# EAGLE design cart (EAGLE 8.7.1)
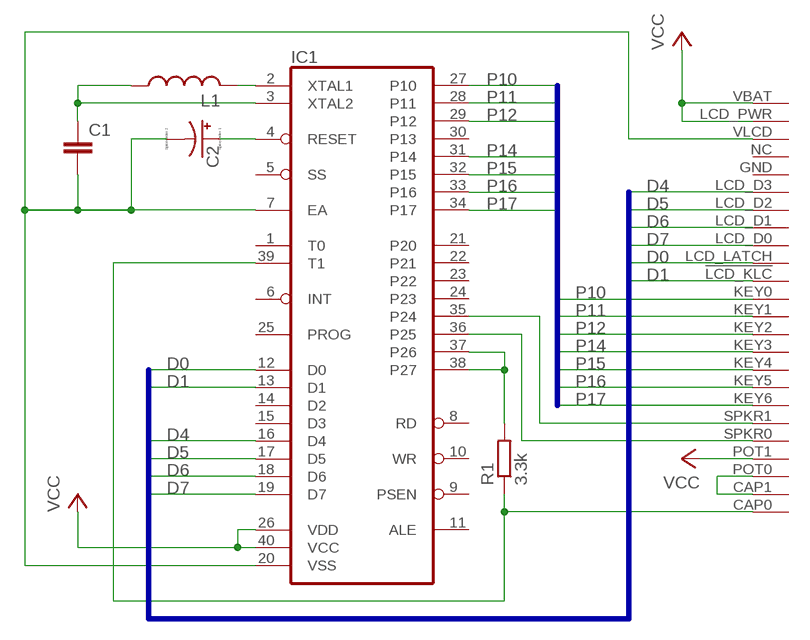
[diagram p0: schematic, sheet 1]

## Parts
C1  C-EU050-024X044  [C050-024X044]
C2  CPOL-USE2.5-5  [E2,5-5]
IC1  8748  [DIL40]
L1  L-US0207/10  [0207/10]
R1  3.3k  R-EU_0204/7  [0204/7]
U$1  CONNECTOR  [CONNECTOR]

## Nets
D0: IC1.12(D0) U$1.LCD_LATCH
D1: IC1.13(D1) U$1.!LCD_KLC(LCD_CLK)
D4: IC1.16(D4) U$1.LCD_D3
D5: IC1.17(D5) U$1.LCD_D2
D6: IC1.18(D6) U$1.LCD_D1
D7: IC1.19(D7) U$1.LCD_D0
N$8: IC1.35(P24) U$1.SPKR1
N$9: IC1.36(P25) U$1.SPKR0
N$10: IC1.37(P26) IC1.38(P27) R1.2
N$11: IC1.39(T1) R1.1 U$1.CAP0
N$12: C1.2 C2.- IC1.7(EA) IC1.20(VSS) U$1.VLCD
N$16: U$1.CAP1 U$1.POT0
N$19: IC1.2(XTAL1) L1.2
N$20: C1.1 IC1.3(XTAL2) L1.1
N$23: C2.+ IC1.4(RESET)
P10: IC1.27(P10) U$1.KEY0
P11: IC1.28(P11) U$1.KEY1
P12: IC1.29(P12) U$1.KEY2
P14: IC1.31(P14) U$1.KEY3
P15: IC1.32(P15) U$1.KEY4
P16: IC1.33(P16) U$1.KEY5
P17: IC1.34(P17) U$1.KEY6
VCC: IC1.26(VDD) IC1.40(VCC) U$1.LCD_PWR U$1.POT1 U$1.VBAT
Unconnected: IC1.1(T0) IC1.5(SS) IC1.6(INT) IC1.8(RD) IC1.9(PSEN) IC1.10(WR) IC1.11(ALE) IC1.14(D2) IC1.15(D3) IC1.21(P20) IC1.22(P21) IC1.23(P22) IC1.24(P23) IC1.25(PROG) IC1.30(P13) U$1.GND U$1.NC

## Buses
D[0..7]
P[10..17]

## Library data of the parts
C1 = resistor:C-EU: CAPACITOR, European symbol
C2 = resistor:CPOL-US: POLARIZED CAPACITOR, American symbol
IC1 = micro-intel:8748: MICROCOMPUTER/PERIPHERAL DEVICE; OC_FARNELL: unknown; OC_NEWARK: unknown
L1 = resistor:L-US: INDUCTOR, American symbol
R1 = resistor:R-EU_: RESISTOR, European symbol
U$1 = microvisionConnector:CONNECTOR

## Net classes
0 default: clearance 0.205 mm

## Board
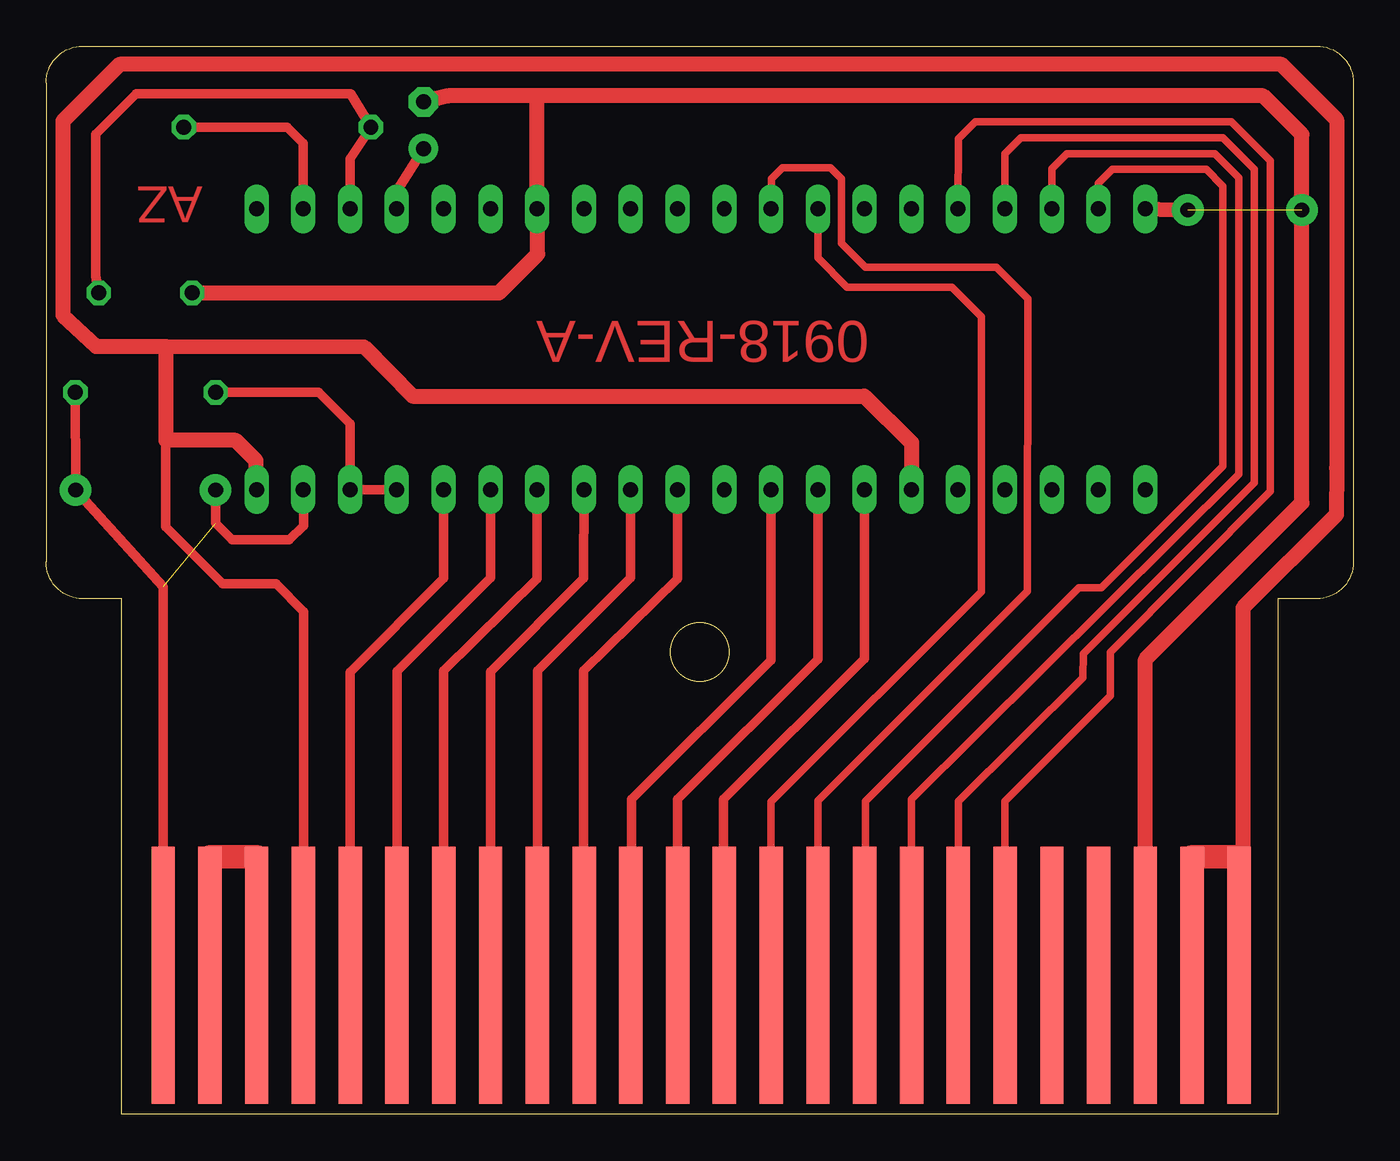
[diagram p1: board, top side]
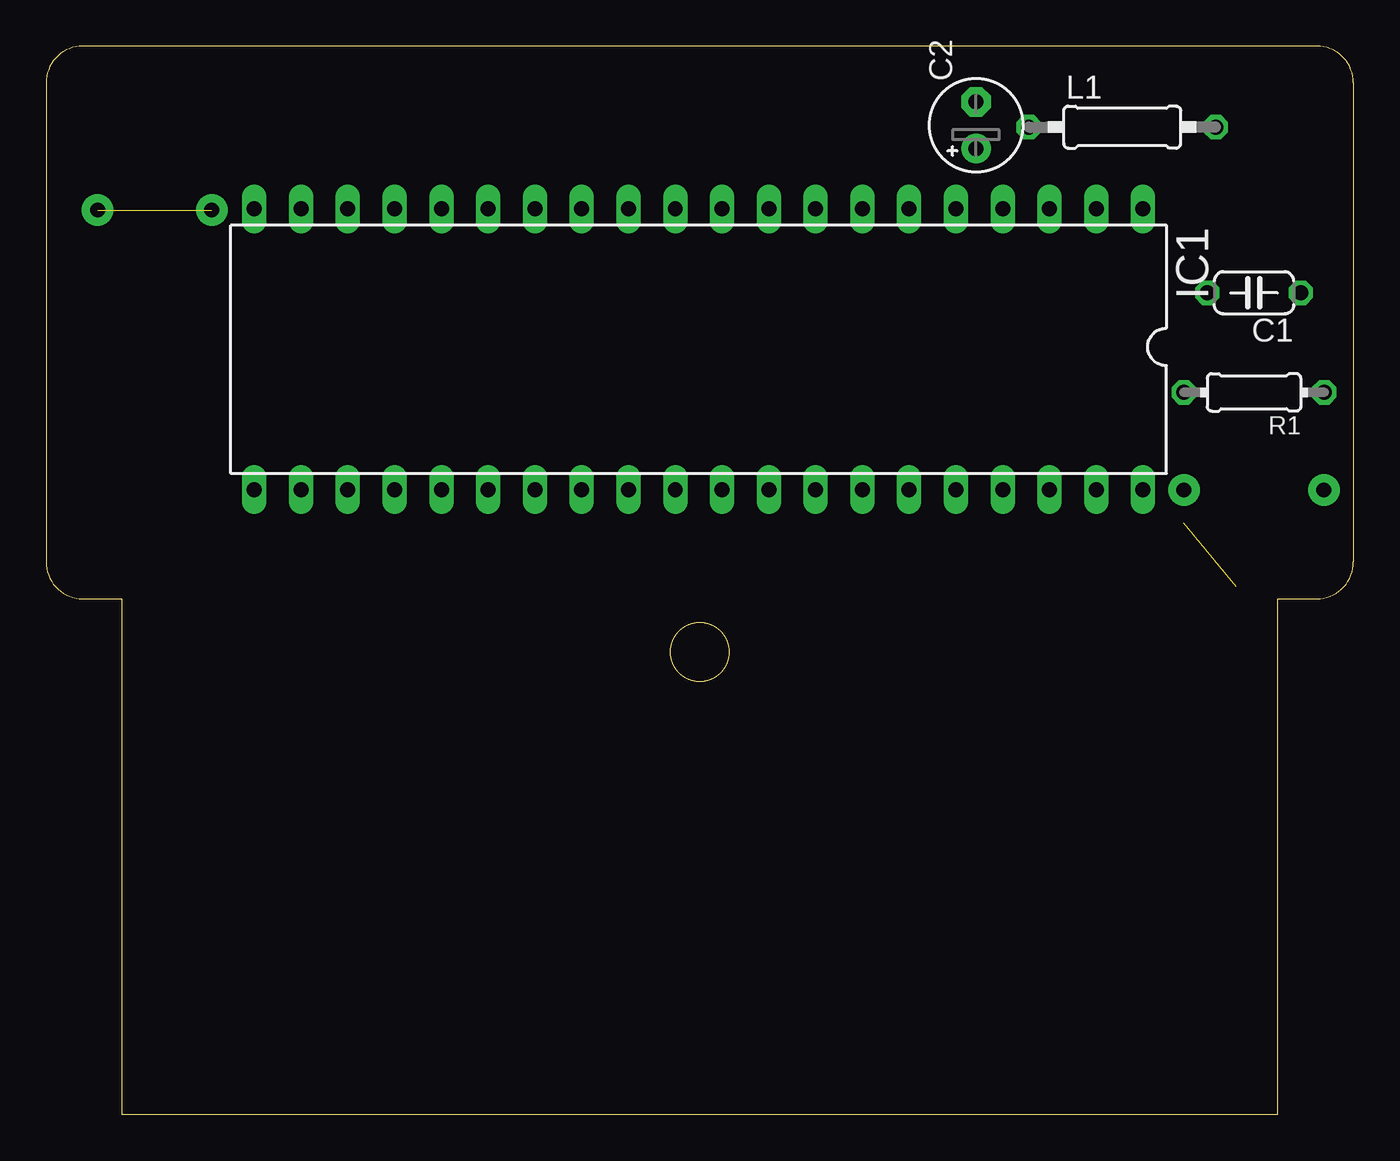
[diagram p2: board, bottom side, seen from below]

Size 71 x 58 mm. Coordinates in mm from the lower left corner, seen from the top.
Outline: 0,56 arc-90 2,58 69,58 arc-90 71,56 71,30 arc-90 69,28 66.9,28 66.9,0 4.1,0 4.1,28 2,28 arc-90 0,30 0,56
Outline: circle at 35.5,25.1 radius 1.6
Copper layers (1*16): Top 0.035mm / dielectric 1.5mm / Bottom 0.035mm
Design rules "default *": minimum track width 6mil, minimum drill 0.35mm, track to track 12mil, track to pad 12mil, pad to pad 12mil, via to via 12mil, smd to smd 12mil, copper to edge 20mil, drill to drill 6mil, minimum pad ring 10mil, minimum via ring 8mil, stop-mask expansion 4mil, vias tented up to drill 0mil, thermal gap 10mil

### Footprints (pad centres in the part's own frame; a part is rotated, then mirrored left to right if it is on the bottom)
C050-024X044 = drill 0.813 octagon: 1 -2.54,0; 2 2.54,0
E2,5-5 = drill 0.813 pad 1.6: + -1.27,0 | drill 0.813 pad 1.6 octagon: - 1.27,0
DIL40 = drill 0.813 long: 1 -24.13,-7.62; 2 -21.59,-7.62; 3 -19.05,-7.62; 4 -16.51,-7.62; 5 -13.97,-7.62; 6 -11.43,-7.62; 7 -8.89,-7.62; 8 -6.35,-7.62; 9 -3.81,-7.62; 10 -1.27,-7.62; 11 1.27,-7.62; 12 3.81,-7.62; 13 6.35,-7.62; 14 8.89,-7.62; 15 11.43,-7.62; 16 13.97,-7.62; 17 16.51,-7.62; 18 19.05,-7.62; 19 21.59,-7.62; 20 24.13,-7.62; 21 24.13,7.62; 22 21.59,7.62; 23 19.05,7.62; 24 16.51,7.62; 25 13.97,7.62; 26 11.43,7.62; 27 8.89,7.62; 28 6.35,7.62; 29 3.81,7.62; 30 1.27,7.62; 31 -1.27,7.62; 32 -3.81,7.62; 33 -6.35,7.62; 34 -8.89,7.62; 35 -11.43,7.62; 36 -13.97,7.62; 37 -16.51,7.62; 38 -19.05,7.62; 39 -21.59,7.62; 40 -24.13,7.62
0207/10 = drill 0.813 octagon: 1 -5.08,0; 2 5.08,0
0204/7 = drill 0.813 octagon: 1 -3.81,0; 2 3.81,0
CONNECTOR = smd 1.27 x 13.97: !LCD_KLC 5.08,-2.54; CAP0 -27.94,-2.54; CAP1 -25.4,-2.54; GND 20.32,-2.54; KEY0 2.54,-2.54; KEY1 0,-2.54; KEY2 -2.54,-2.54; KEY3 -5.08,-2.54; KEY4 -7.62,-2.54; KEY5 -10.16,-2.54; KEY6 -12.7,-2.54; LCD_D0 10.16,-2.54; LCD_D1 12.7,-2.54; LCD_D2 15.24,-2.54; LCD_D3 17.78,-2.54; LCD_LATCH 7.62,-2.54; LCD_PWR 27.94,-2.54; NC 22.86,-2.54; POT0 -22.86,-2.54; POT1 -20.32,-2.54; SPKR0 -17.78,-2.54; SPKR1 -15.24,-2.54; VBAT 30.48,-2.54; VLCD 25.4,-2.54

### Placement (x,y rotation side)
C1  5.4,44.6 180 bottom
C2  20.5,53.7 90 bottom
IC1  35.56,41.54 180 bottom
L1  12.56,53.6 0 bottom
R1  5.4,39.2 180 bottom
U$1  34.3,10.1 0 top

### Tracks (layer width: path | path; a pad name or v marks a point on that pad's centre or on a via)
D0
  Top 0.406: U$1.LCD_LATCH 41.92,17.02 53.3,28.4 53.33,44.27 51.6,46 44.5,46 43.2,47.3 43.2,50.8 42.6,51.4 40,51.4 39.4,50.8 39.4,49.6 IC1.12
D1
  Top 0.406: U$1.!LCD_KLC 39.38,16.98 50.8,28.38 50.8,43.3 49.2,44.9 43.5,44.9 41.91,46.51 IC1.13
D4
  Top 0.406: U$1.LCD_D3 52.08,17.02 57.8,22.74 57.8,25.1 66.49,33.83 66.49,51.77 64.37,53.89 50.47,53.89 49.54,52.96 IC1.16
D5
  Top 0.406: U$1.LCD_D2 49.54,17.01 56.3,23.7 56.33,25 65.63,34.28 65.63,51.31 63.92,53.03 52.95,53.03 52.08,52.16 IC1.17
D6
  Top 0.406: U$1.LCD_D1 47,17.1 64.76,34.74 64.76,50.86 63.46,52.16 55.44,52.16 54.61,51.33 IC1.18
D7
  Top 0.406: U$1.LCD_D0 44.5,7.6 44.5,17 56.1,28.6 57.3,28.6 63.9,35.2 63.9,50.4 63,51.3 57.9,51.3 57.15,50.55 IC1.19
N$8
  Top 0.508: U$1.SPKR1 19.06,24.06 24.13,29.13 IC1.35
N$9
  Top 0.508: U$1.SPKR0 16.52,24.02 21.6,29.1 21.6,31.91 IC1.36
N$10
  Top 0.508: R1.2 14.8,39.2 16.51,37.49 IC1.38 IC1.37
N$11  (via drill 0.81 pad 1.72)  (1 unrouted)
  Top 0.508: U$1.CAP0 6.36,28.66 v1.6,33.9 1.6,34.19 R1.1 | v9.2,33.9 9.2,32.1 10.11,31.2 13.2,31.19 14,31.95 IC1.39
N$12  (via drill 0.81 pad 1.72)  (1 unrouted)
  Top 0.813: U$1.VLCD 59.7,24.7 68.2,33.2 v68.2,49.1 68.2,53.2 66.1,55.3 26.7,55.3 | IC1.20 v62,49.1 | 26.7,55.3 21.83,55.3 C2.- | C1.2 24.6,44.6 26.7,46.7 26.7,49.13 IC1.7 26.67,55.27 26.7,55.3
N$16
  Top 1.016: U$1.CAP1 8.9,14 | 11.5,14 11.44,14 U$1.POT0
  Top 1.27: 8.9,14 11.44,14
N$19
  Top 0.508: IC1.2 13.97,52.73 13.1,53.6 L1.2
N$20
  Top 0.508: IC1.3 16.51,51.87 L1.1 16.54,55.4 4.9,55.4 2.7,53.2 2.7,45.5 C1.1
N$23
  Top 0.508: IC1.4 19.05,50.13 C2.+
P10
  Top 0.152: 36.8,7.6 U$1.KEY0
  Top 0.508: IC1.27 44.45,24.75 36.8,17.1 36.8,7.6
P11
  Top 0.508: IC1.28 41.91,24.71 34.3,17.1 U$1.KEY1
P12
  Top 0.152: 31.8,7.6 U$1.KEY2
  Top 0.508: IC1.29 39.37,24.67 31.8,17.1 31.8,7.6
P14
  Top 0.152: 29.2,7.68 U$1.KEY3
  Top 0.508: IC1.31 34.29,29.09 29.2,24.1 29.2,7.68
P15
  Top 0.508: IC1.32 31.75,29.15 26.7,24.1 U$1.KEY4
P16
  Top 0.508: IC1.33 29.2,29.1 24.14,24.04 U$1.KEY5
P17
  Top 0.508: IC1.34 26.67,29.07 21.6,24.1 U$1.KEY6
VCC
  Top 0.508: 6.5,36.6 6.5,31.9 9.6,28.8 12.5,28.8 14,27.3 14,7.58 U$1.POT1
  Top 0.813: 64.78,14 65,14.22 65,27.5 70.08,32.57 70.08,35.08 70.08,54 67.08,57 4,57 0.92,53.92 0.92,43.4 2.71,41.7 6.5,41.7 | 6.5,41.7 6.5,36.6 10.3,36.6 11.4,35.5 IC1.40 | 6.5,41.7 17.26,41.66 19.9,39 44.44,39 47.01,36.47 IC1.26
  Top 1.27: U$1.LCD_PWR 62.24,14 64.78,14 U$1.VBAT

### Text on the board
Top: AZ | 0918-REV-A